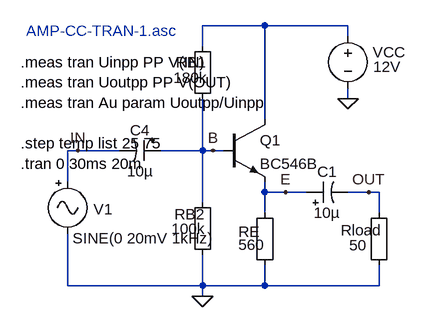
[diagram p0: schematic AMP-CC-TRAN-1.asc]
AMP-CC-TRAN-1.asc, the LTspice schematic file:
Version 4
SHEET 1 880 680
WIRE 192 -32 96 -32
WIRE 320 -32 192 -32
WIRE 320 -16 320 -32
WIRE 96 0 96 -32
WIRE 320 80 320 64
WIRE 192 112 192 -32
WIRE -96 160 -112 160
WIRE -32 160 -96 160
WIRE 96 160 96 80
WIRE 96 160 32 160
WIRE 112 160 96 160
WIRE 128 160 112 160
WIRE -112 208 -112 160
WIRE 192 224 192 208
WIRE 224 224 192 224
WIRE 256 224 224 224
WIRE 352 224 320 224
WIRE 368 224 352 224
WIRE 96 240 96 160
WIRE 192 256 192 224
WIRE 368 256 368 224
WIRE -112 368 -112 288
WIRE 96 368 96 320
WIRE 96 368 -112 368
WIRE 192 368 192 336
WIRE 192 368 96 368
WIRE 368 368 368 336
WIRE 368 368 192 368
WIRE 96 384 96 368
FLAG 320 80 0
FLAG -96 160 IN
FLAG 96 384 0
FLAG 112 160 B
FLAG 224 224 E
FLAG 352 224 OUT
SYMBOL npn 128 112 R0
SYMATTR InstName Q1
SYMATTR Value BC546B
SYMBOL Misc\\EuropeanResistor 80 -16 R0
WINDOW 0 -25 40 Left 2
WINDOW 3 -29 64 Left 2
SYMATTR InstName RB1
SYMATTR Value 180k
SYMBOL Misc\\signal -112 192 R0
WINDOW 123 8 119 Left 2
WINDOW 0 40 58 Left 2
WINDOW 3 8 103 Left 2
WINDOW 39 0 0 Left 0
SYMATTR InstName V1
SYMATTR Value SINE(0 20mV 1kHz)
SYMBOL voltage 320 -32 R0
WINDOW 0 38 41 Left 2
WINDOW 3 39 63 Left 2
WINDOW 123 0 0 Left 2
WINDOW 39 0 0 Left 2
SYMATTR InstName VCC
SYMATTR Value 12V
SYMBOL polcap 32 144 R90
WINDOW 0 0 32 VBottom 2
WINDOW 3 32 32 VTop 2
SYMATTR InstName C4
SYMATTR Value 10µ
SYMATTR Description Capacitor
SYMATTR Type cap
SYMATTR SpiceLine V=6.3 Irms=15m Rser=2.3181 Lser=1.92n mfg="Wьrth Elektronik" pn="865090140001 WCAP-ASLU 4x5,5" type="Al electrolytic"
SYMBOL Misc\\EuropeanResistor 176 240 R0
WINDOW 0 -25 45 Left 2
WINDOW 3 -25 65 Left 2
SYMATTR InstName RE
SYMATTR Value 560
SYMBOL Misc\\EuropeanResistor 80 224 R0
WINDOW 0 -27 34 Left 2
WINDOW 3 -32 56 Left 2
SYMATTR InstName RB2
SYMATTR Value 100k
SYMBOL polcap 256 240 R270
WINDOW 0 32 32 VTop 2
WINDOW 3 0 32 VBottom 2
SYMATTR InstName C1
SYMATTR Value 10µ
SYMATTR Description Capacitor
SYMATTR Type cap
SYMATTR SpiceLine V=63 Irms=40m Rser=1.4137 Lser=2.07n mfg="Wьrth Elektronik" pn="865080743010 WCAP-ASLI 6,3x5,5" type="Al electrolytic"
SYMBOL Misc\\EuropeanResistor 352 240 R0
WINDOW 0 -43 43 Left 2
WINDOW 3 -30 66 Left 2
SYMATTR InstName Rload
SYMATTR Value 50
TEXT -184 24 Left 2 !.meas tran Uinpp PP V(IN)\n.meas tran Uoutpp PP V(OUT)\n.meas tran Au param Uoutpp/Uinpp\n \n.step temp list 25 75\n.tran 0 30ms 20m
TEXT -176 -24 Left 2 ;AMP-CC-TRAN-1.asc

The netlist it stands for:
* AMP-CC-TRAN-1.asc
Q1 N001 B E 0 BC546B
RB1 N001 B 180k
V1 IN 0 SINE(0 20mV 1kHz)
VCC N001 0 12V
C4 B IN 10µ V=6.3 Irms=15m Rser=2.3181 Lser=1.92n mfg="Wьrth Elektronik" pn="865090140001 WCAP-ASLU 4x5,5" type="Al electrolytic"
RE E 0 560
RB2 B 0 100k
C1 E OUT 10µ V=63 Irms=40m Rser=1.4137 Lser=2.07n mfg="Wьrth Elektronik" pn="865080743010 WCAP-ASLI 6,3x5,5" type="Al electrolytic"
Rload OUT 0 50
.model NPN NPN
.model PNP PNP
.lib standard.bjt
.meas tran Uinpp PP V(IN)
.meas tran Uoutpp PP V(OUT)
.meas tran Au param Uoutpp/Uinpp
.step temp list 25 75
.tran 0 30ms 20m
* AMP-CC-TRAN-1.asc
.backanno
.end